# Altium schematic sheet MAX232_0-99_Counter.SchDoc
size A; SheetNumber: 2; SheetTotal: 2
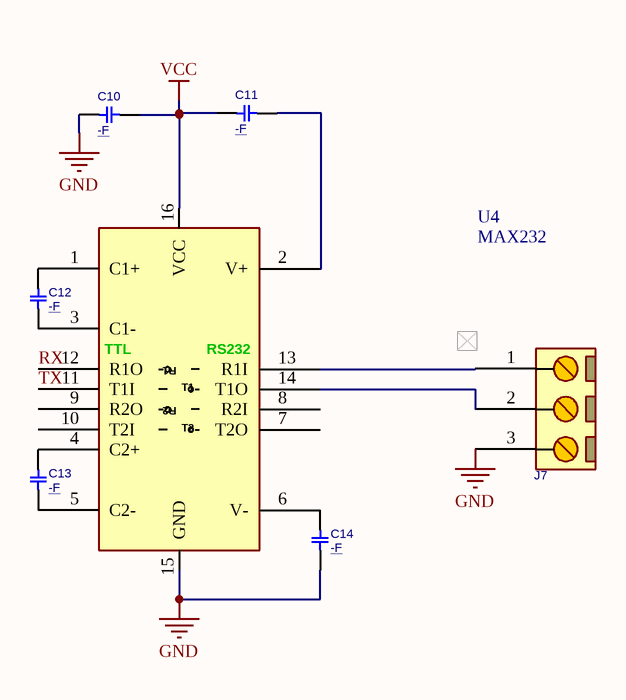
[diagram p0: MAX232_0-99_Counter.SchDoc]

## Parts
C10  -F  [C0805]
C11  -F  [C0805]
C12  -F  [C0805]
C13  -F  [C0805]
C14  -F  [C0805]
J7  CONN_TB3  [MSTB_3]  (value not drawn)
U4  MAX232  [SO_16]

## Nets
GND: C10.1 C14.1 J7.3 U4.15(GND)
VCC: C10.2 C11.1 U4.16(VCC)
RX: U4.12(R1O)
TX: U4.11(T1I)
NetC11_2: C11.2 U4.2(V+)
NetC12_1: C12.1 U4.3(C1-)
NetC12_2: C12.2 U4.1(C1+)
NetC13_1: C13.1 U4.5(C2-)
NetC13_2: C13.2 U4.4(C2+)
NetC14_2: C14.2 U4.6(V-)
NetJ7_1: J7.1 U4.13(R1I)
NetJ7_2: J7.2 U4.14(T1O)

Not connected (* = marked no-connect by the designer): U4 7(T2O) 8(R2I) 9(R2O) 10(T2I)

## Notes on the sheet
- (in symbol MAX232_SOP16) TTL; RS232; R1; T1; R2; T2

## Library data of the parts
C10-C14 = CAP_SMD_MLCC_0805: CAP, MLCC, -F, -V, MATERIAL, -%, 0201; PARAM: -, -%; MANF_P#: MANF_PART#; PRICE: 100= 1$; MANF: -; PARAM2: -V; ASSEMBLY: ASSEMBLY; VALUE: -F
J7 = CONN_MSTB_3: CONN, PHOENIX MSTB, 5-G, 5.08mm pitch; VALUE: CONN_TB3
U4 = MAX232_SOP16: RS-232, DUAL, +5V, Driver/Receiver; MANF_PART#: MAX232ACSE; MANF: Maxim Integrated; PARAM: PARAM; PRICE: 2000toman@PAYA; VALUE: MAX232